# EasyEDA schematic SCH_Curtain PCB_2022-04-27.json
TITLE: Roller blinds; REV: 1.0; Date: 2022-02-15; Sheet: 1/1; Company: Sander van Kasteel
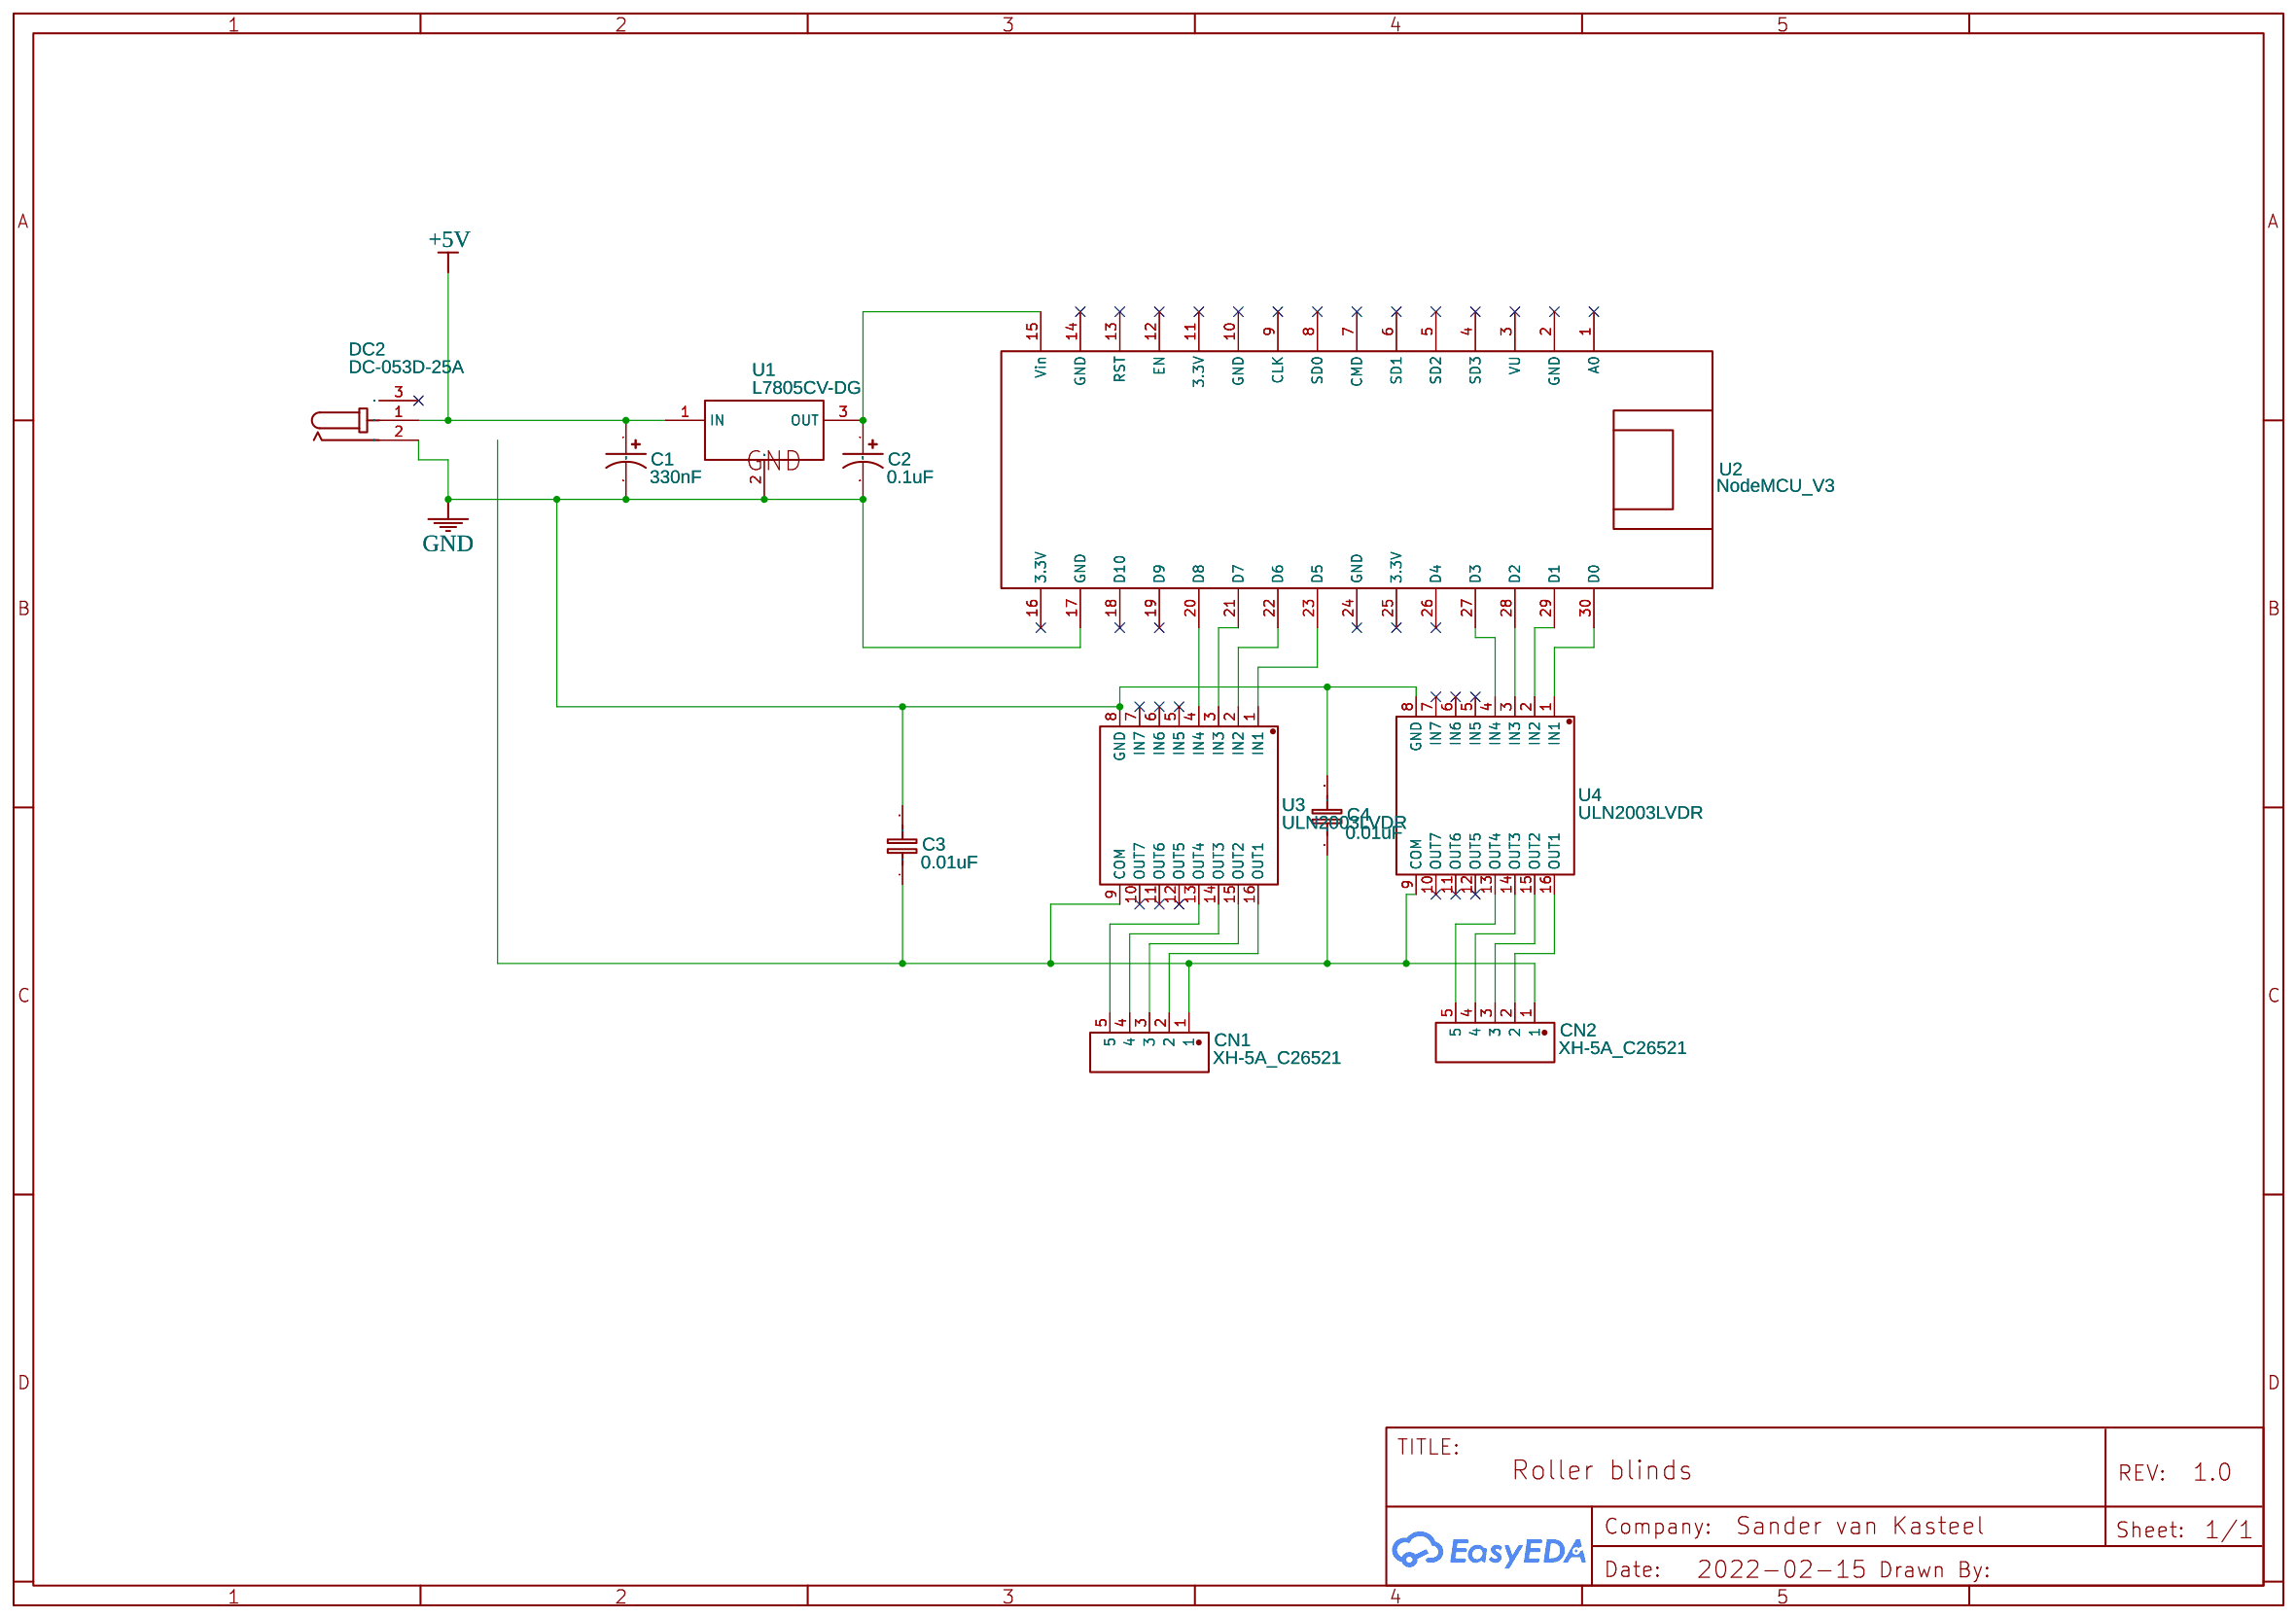
[diagram p0: schematic sheet]

## Parts
C1  330nF  [C1206]
C2  0.1uF  [C0805]
C3  0.01uF  [C0603]
C4  0.01uF  [C0603]
CN1  XH-5A_C26521  [CONN-TH_5P-P2.50_XH-5A]
CN2  XH-5A_C26521  [CONN-TH_5P-P2.50_XH-5A]
DC2  DC-053D-25A  [DC-IN-TH_DC-053D-25A-1]
U1  L7805CV-DG  [TO-220-3_L10.0-W4.5-P2.54-L]
U2  NodeMCU_V3  [NODEMCU_V3]
U3  ULN2003LVDR  [SOIC-16_L9.9-W3.9-P1.27-LS6.0-BL]
U4  ULN2003LVDR  [SOIC-16_L9.9-W3.9-P1.27-LS6.0-BL]

## Library data of the parts
C1 = C_Tan_SMD_A_US: Supplier Part: C73142; Supplier: LCSC; Contributor: LCEDA_Lib; Manufacturer Part: CL21B334KBFNNNE; Manufacturer: SAMSUNG
C2 = C_Tan_SMD_A_US: Supplier Part: C126469; Supplier: LCSC; Contributor: LCEDA_Lib; Manufacturer Part: CT41G-0805-2X1-50V-0.1uF-K(N); Manufacturer: TORCH
C3 C4 = C_0603_EU: Supplier Part: C138345; Supplier: LCSC; Contributor: LCEDA_Lib; Manufacturer Part: CT41-0603-2X1-50V-0.01uF-K(N); Manufacturer: TORCH
CN1 CN2 = XH-5A_C26521: Supplier Part: C26521; Supplier: LCSC; Manufacturer: ReliaPro; Manufacturer Part: XH-5A; JLCPCB Part Class: Extended Part
DC2 = DC-053D-25A: Supplier: LCSC; Supplier Part: C2686352; Manufacturer: 韩国韩荣; Contributor: LCSC; JLCPCB Part Class: Extended Part
U1 = L7805CV-DG: Supplier: LCSC; Manufacturer: STMicroelectronics; Supplier Part: C3795; JLCPCB Part Class: Extended Part
U2 = NodeMCU_V3: Contributor: Shaun Madison; Package Display: No
U3 U4 = ULN2003LVDR: Supplier: LCSC; Supplier Part: C72751; Manufacturer: Texas Instruments; Contributor: LCSC; JLCPCB Part Class: Extended Part

## Nets
+5V: C1.1 DC2.1 U1.1(IN)
GND: C1.2 C2.2 C3.2 C4.2 DC2.2 U1.2(GND) U2.17(GND) U3.8(GND) U4.8(GND)
Net-(C2-1): C2.1 U1.3(OUT) U2.15(Vin)
Net-(C3-1): C3.1 C4.1 CN1.1 CN2.1 U3.9(COM) U4.9(COM)
Net-(CN1-2): CN1.2 U3.16(OUT1)
Net-(CN1-3): CN1.3 U3.15(OUT2)
Net-(CN1-4): CN1.4 U3.14(OUT3)
Net-(CN1-5): CN1.5 U3.13(OUT4)
Net-(CN2-2): CN2.2 U4.16(OUT1)
Net-(CN2-3): CN2.3 U4.15(OUT2)
Net-(CN2-4): CN2.4 U4.14(OUT3)
Net-(CN2-5): CN2.5 U4.13(OUT4)
Net-(U2-20): U2.20(D8) U3.4(IN4)
Net-(U2-21): U2.21(D7) U3.3(IN3)
Net-(U2-22): U2.22(D6) U3.2(IN2)
Net-(U2-23): U2.23(D5) U3.1(IN1)
Net-(U2-27): U2.27(D3) U4.4(IN4)
Net-(U2-28): U2.28(D2) U4.3(IN3)
Net-(U2-29): U2.29(D1) U4.2(IN2)
Net-(U2-30): U2.30(D0) U4.1(IN1)

Not connected (* = marked no-connect by the designer): DC2 3*; U2 1(A0)* 2(GND)* 3(VU)* 4(SD3)* 5(SD2)* 6(SD1)* 7(CMD)* 8(SD0)* 9(CLK)* 10(GND)* 11(3.3V)* 12(EN)* 13(RST)* 14(GND)* 16(3.3V)* 18(D10)* 19(D9)* 24(GND)* 25(3.3V)* 26(D4)*; U3 5(IN5)* 6(IN6)* 7(IN7)* 10(OUT7)* 11(OUT6)* 12(OUT5)*; U4 5(IN5)* 6(IN6)* 7(IN7)* 10(OUT7)* 11(OUT6)* 12(OUT5)*
